# EAGLE schematic ultrasonic_sensor (EAGLE 8.3.0)
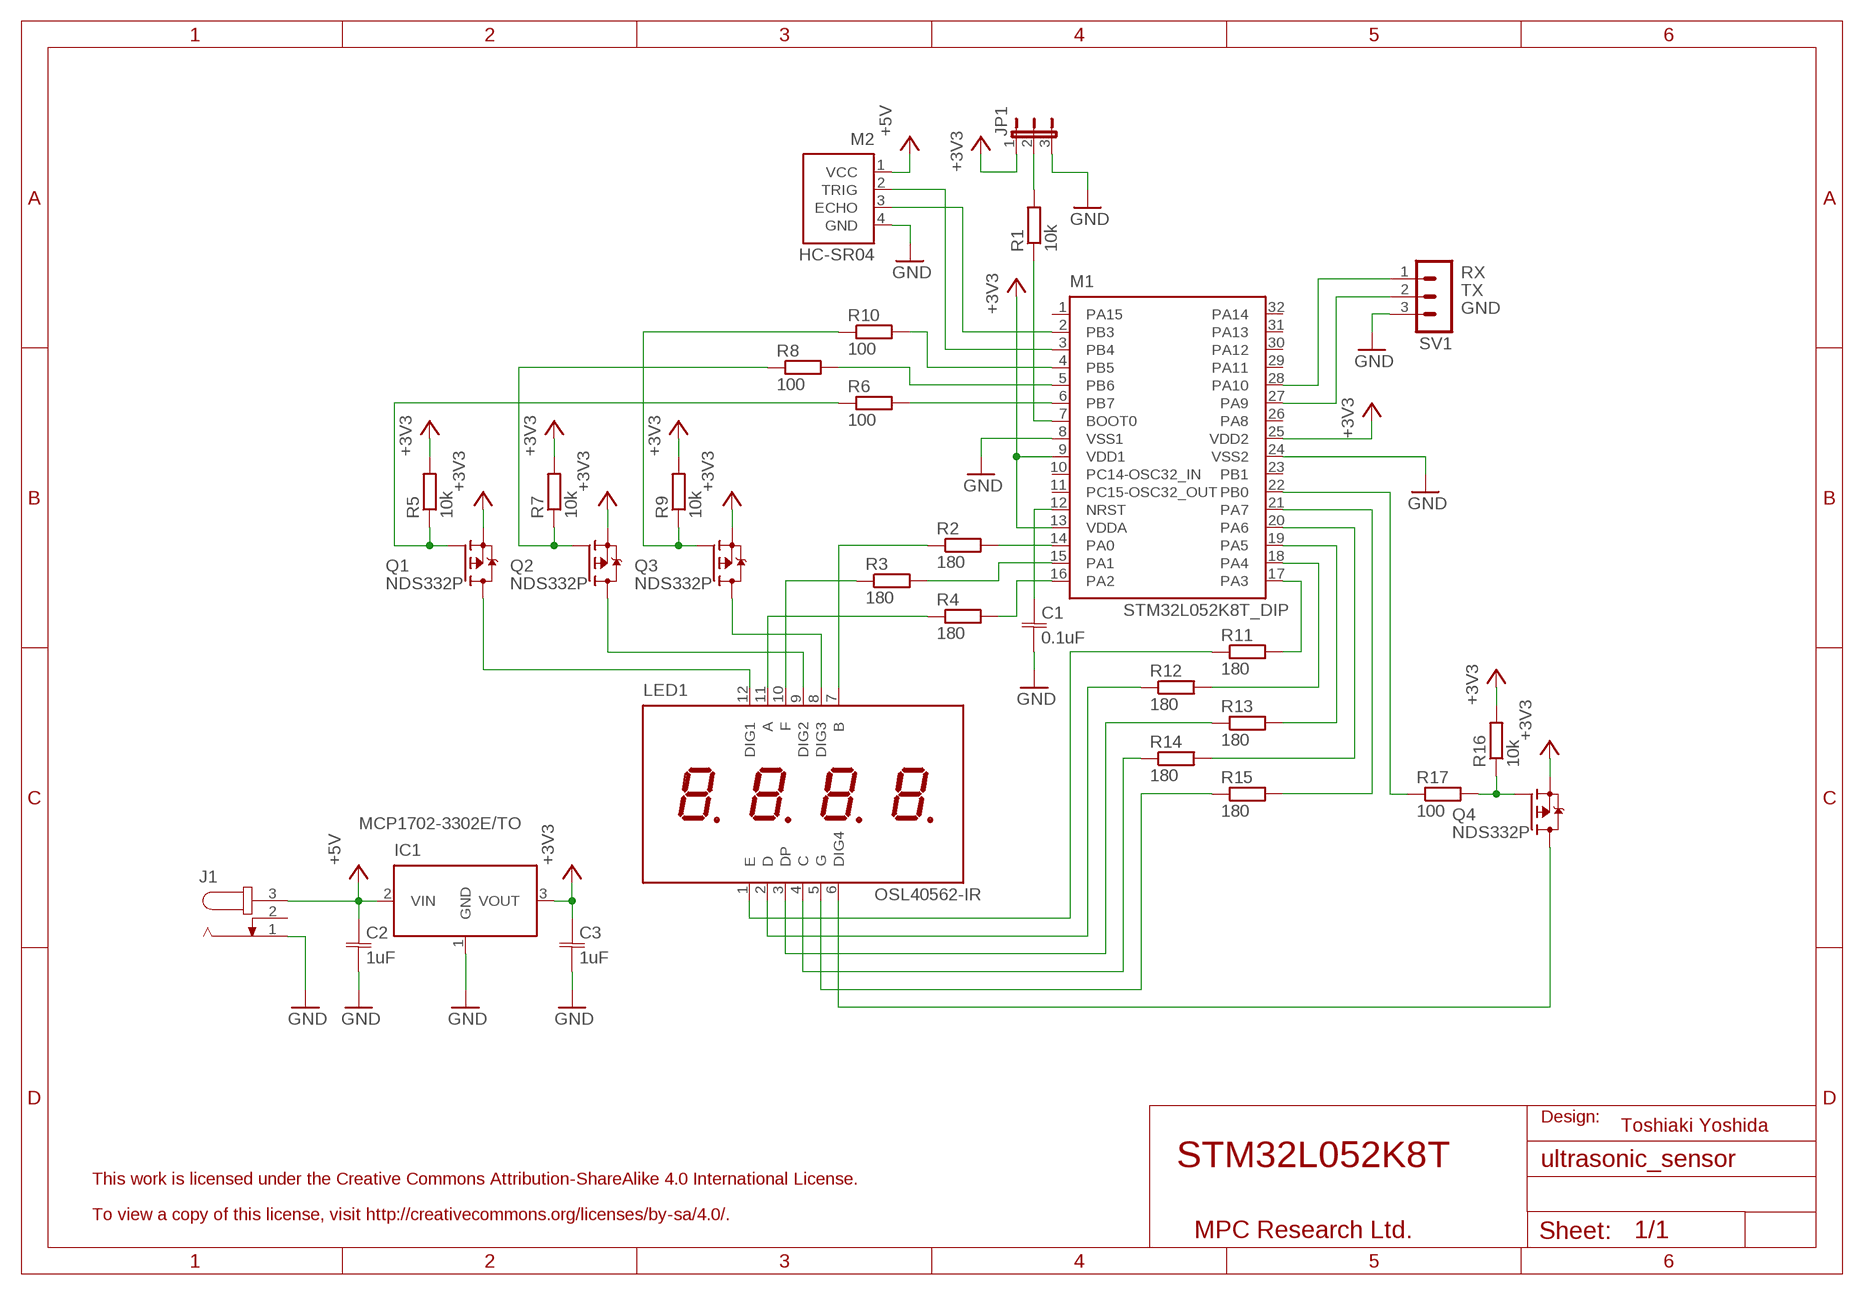
[diagram p0: schematic, sheet 1]

## Parts
C1  0.1uF  C-JIS050-024X044  [C050-024X044]
C2  1uF  C-JIS050-024X044  [C050-024X044]
C3  1uF  C-JIS050-024X044  [C050-024X044]
IC1  MCP1702-3302E/TO  [TO92]
J1  JACK-PLUG0  [SPC4077]
JP1  JP2E  [JP2]
LED1  OSL40562-IR  [OSL40562-IR]
M1  STM32L052K8T_DIP  [DIP32]
M2  HC-SR04  [HC-SR04]
Q1  NDS332P  [SOT23]
Q2  NDS332P  [SOT23]
Q3  NDS332P  [SOT23]
Q4  NDS332P  [SOT23]
R1  10k  R-EU_0207/2V  [0207/2V]
R2  180  R-EU_0207/2V  [0207/2V]
R3  180  R-EU_0207/2V  [0207/2V]
R4  180  R-EU_0207/2V  [0207/2V]
R5  10k  R-EU_0207/2V  [0207/2V]
R6  100  R-EU_0207/2V  [0207/2V]
R7  10k  R-EU_0207/2V  [0207/2V]
R8  100  R-EU_0207/2V  [0207/2V]
R9  10k  R-EU_0207/2V  [0207/2V]
R10  100  R-EU_0207/2V  [0207/2V]
R11  180  R-EU_0207/2V  [0207/2V]
R12  180  R-EU_0207/2V  [0207/2V]
R13  180  R-EU_0207/2V  [0207/2V]
R14  180  R-EU_0207/2V  [0207/2V]
R15  180  R-EU_0207/2V  [0207/2V]
R16  10k  R-EU_0207/2V  [0207/2V]
R17  100  R-EU_0207/2V  [0207/2V]
SV1  MA03-1  [MA03-1]

## Nets
+3V3: C3.1 IC1.3(VOUT) JP1.1 M1.9(VDD1) M1.13(VDDA) M1.25(VDD2) Q1.2(S) Q2.2(S) Q3.2(S) Q4.2(S) R5.2 R7.2 R9.2 R16.2
+5V: C2.1 IC1.2(VIN) J1.3 M2.1(VCC)
GND: C1.2 C2.2 C3.2 IC1.1(GND) J1.1 JP1.3 M1.8(VSS1) M1.24(VSS2) M2.4(GND) SV1.3
N$1: M1.27(PA9) SV1.2
N$2: M1.7(BOOT0) R1.1
N$3: M1.28(PA10) SV1.1
N$4: C1.1 M1.12(NRST)
N$5: M1.14(PA0) R2.2
N$6: JP1.2 R1.2
N$7: LED1.7(B) R2.1
N$8: M1.15(PA1) R3.2
N$9: LED1.10(F) R3.1
N$10: M1.16(PA2) R4.2
N$11: LED1.11(A) R4.1
N$12: M1.6(PB7) R6.2
N$13: Q1.1(G) R5.1 R6.1
N$14: LED1.12(DIG1) Q1.3(D)
N$15: M1.5(PB6) R8.2
N$16: Q2.1(G) R7.1 R8.1
N$17: LED1.9(DIG2) Q2.3(D)
N$18: M1.4(PB5) R10.2
N$19: Q3.1(G) R9.1 R10.1
N$20: LED1.8(DIG3) Q3.3(D)
N$21: M1.17(PA3) R11.2
N$22: LED1.1(E) R11.1
N$23: M1.18(PA4) R12.2
N$24: LED1.2(D) R12.1
N$25: M1.19(PA5) R13.2
N$26: R13.1
N$27: LED1.3(DP)
N$28: M1.20(PA6) R14.2
N$29: LED1.4(C) R14.1
N$30: M1.21(PA7) R15.2
N$31: LED1.5(G) R15.1
N$32: M1.22(PB0) R17.1
N$33: LED1.6(DIG4) Q4.3(D)
N$34: M1.3(PB4) M2.2(TRIG)
N$35: Q4.1(G) R16.1 R17.2
N$36: M1.2(PB3) M2.3(ECHO)
Unconnected: J1.2 M1.1(PA15) M1.10(PC14-OSC32_IN) M1.11(PC15-OSC32_OUT) M1.23(PB1) M1.26(PA8) M1.29(PA11) M1.30(PA12) M1.31(PA13) M1.32(PA14)

## Notes on the sheet
- RX
- TX
- GND
- Design:
- Toshiaki Yoshida
- STM32L052K8T
- This work is licensed under the Creative Commons Attribution-ShareAlike 4.0 International License.
- To view a copy of this license, visit http://creativecommons.org/licenses/by-sa/4.0/.
- MPC Research Ltd.

## Library data of the parts
C1-C3 = cap:C-JIS: CAPACITOR, Japanese symbol
IC1 = v-reg:MCP1702: MCP1702 250mA Low Quiescent Current LDO Regulator; VOLTAGE: 3.3V
J1 = con-jack:JACK-PLUG: DC POWER JACK Power Jack, DC, Right Angle, Through Hole, Rated 5A at 16VDC, PC Terminals Distributor: Farnell (www.Farnell.de) Drawing: 84N1161.pdf / 84N1162.pdf Manufacturer: SPC Technology (www.spctechnology.com) Type: SPC4077 / SPC 4078; OC_FARNELL: unknown; OC_NEWARK: unknown
JP1 = jumper:JP2E: JUMPER
LED1 = led-7-segment:OSL40562-IR: 0.56" Four Digital Display Common Anode type
M1 = stm32:STM32L052K8T_DIP
M2 = sparkfun:HC-SR04: Ultrasonic Ranging Module HC-SR04
Q1-Q4 = transistor-fet:NDS332P: NDS332P P-Channel Logic Level Enhancement Mode Field Effect Transistor
R1-R17 = resistor:R-EU_: RESISTOR, European symbol
SV1 = con-lstb:MA03-1: PIN HEADER; OC_FARNELL: unknown; OC_NEWARK: unknown